# Altium schematic sheet P05_Power.SchDoc
size A4
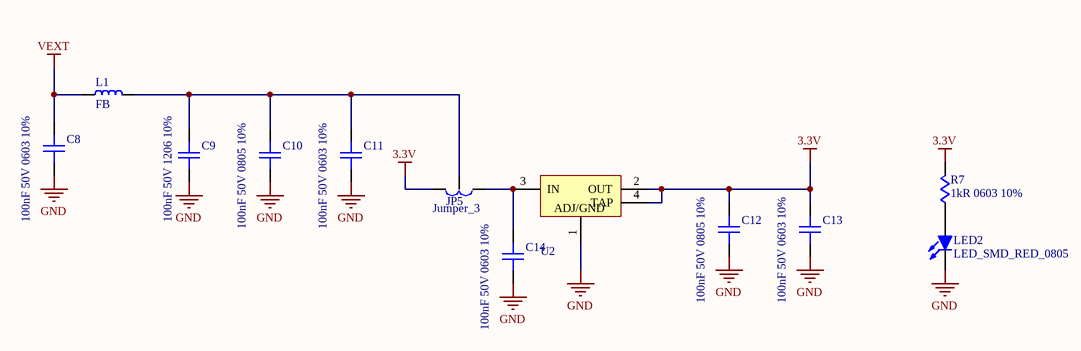
[diagram p0: P05_Power.SchDoc]

## Parts
C8  100nF 50V 0603 10%  [CAPC-0603-M]
C9  100nF 50V 1206 10%  [CAPC-1206-M]
C10  100nF 50V 0805 10%  [CAPC-0805-M]
C11  100nF 50V 0603 10%  [CAPC-0603-M]
C12  100nF 50V 0805 10%  [CAPC-0805-M]
C13  100nF 50V 0603 10%  [CAPC-0603-M]
C14  100nF 50V 0603 10%  [CAPC-0603-M]
JP5  Jumper_3  [JMP_SMD_3]
L1  FB  [INDC-0805-M]
LED2  LED_SMD_RED_0805  [LED-RED-0805-M]
R7  1kR 0603 10%  [RESC-0603-M]
U2  LM1117_3.3V_SMD  [SOT223-4M]  (value not drawn)

## Nets
3.3V: C12.1 C13.1 JP5.3(C) R7.2(B) U2.2(OUT) U2.4(TAP)
GND: C8.2 C9.2 C10.2 C11.2 C12.2 C13.2 C14.2 LED2.2(K) U2.1(ADJ/GND)
VEXT: C8.1 L1.1(A)
NetC9_1: C9.1 C10.1 C11.1 JP5.2(B) L1.2(B)
NetC14_1: C14.1 JP5.1(A) U2.3(IN)
NetLED2_1: LED2.1(A) R7.1(A)

## Library data of the parts
C8 C11 C13 C14 = CAP_SMD_0603
C9 = CAP_SMD_1206
C10 C12 = CAP_SMD_0805
L1 = IND_SMD_0805
R7 = RES_SMD_0603